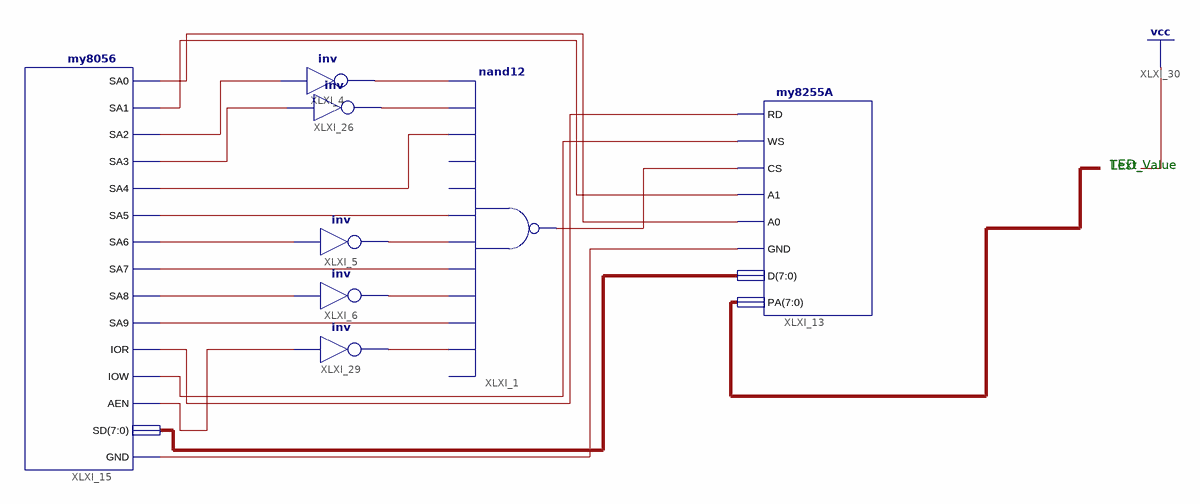
[diagram p0: schematic sheet 1]
// Xilinx ISE schematic all.sch (artix7) as structural Verilog: 8 symbols, 0 ports
module all (
);

  wire XLXN_10, XLXN_26, XLXN_30, XLXN_32, XLXN_36, XLXN_40, XLXN_42, XLXN_43, XLXN_44, XLXN_45, XLXN_46,
       XLXN_49, XLXN_50, XLXN_51, XLXN_52, XLXN_53, XLXN_55, XLXN_56, XLXN_57, XLXN_58;
  wire [7:0] XLXN_59, XLXN_60;

  my8255A XLXI_13 (
    .RD(XLXN_42), .WS(XLXN_43), .CS(XLXN_57), .A1(XLXN_26), .A0(XLXN_10), .GND(XLXN_58), .D(XLXN_59),
    .PA(XLXN_60));
  my8056 XLXI_15 (
    .SA0(XLXN_10), .SA1(XLXN_26), .SA2(XLXN_44), .SA3(XLXN_49), .SA4(XLXN_30), .SA5(XLXN_32), .SA6(XLXN_50),
    .SA7(XLXN_36), .SA8(XLXN_52), .SA9(XLXN_40), .IOR(XLXN_42), .IOW(XLXN_43), .AEN(XLXN_55), .SD(XLXN_59),
    .GND(XLXN_58));
  not XLXI_4 (XLXN_45, XLXN_44);
  not XLXI_26 (XLXN_46, XLXN_49);
  not XLXI_5 (XLXN_51, XLXN_50);
  not XLXI_6 (XLXN_53, XLXN_52);
  not XLXI_29 (XLXN_56, XLXN_55);
  nand XLXI_1 (XLXN_57, XLXN_56, XLXN_40, XLXN_53, XLXN_36, XLXN_51, XLXN_32, XLXN_30, XLXN_46, XLXN_45);  // open: I0, I7, I8

  // Notes on the sheet:
  //   LED
  //   Text_Value
endmodule
